# Altium schematic sheet sch1.SchDoc: Интерфейc PWB
size 420 x 297 mm; CheckedBy: Станкевич; Author: Семенюк; CompanyName: БГУИР, гр.750701; DrawnBy: Семенюк; Organization: БГУИР, гр.750701; Address1: Address1; Address2: Address2; Address3: Address3; Address4: Address4; DocumentNumber: АБВГ.123456.001 Э3; SheetNumber: 1; SheetTotal: 5; Scale: 1:1; Title2str: Микроконтроллер; DocumentType: Схема электрическая принципиальная; FirstReferrence: АБВГ.123456.001
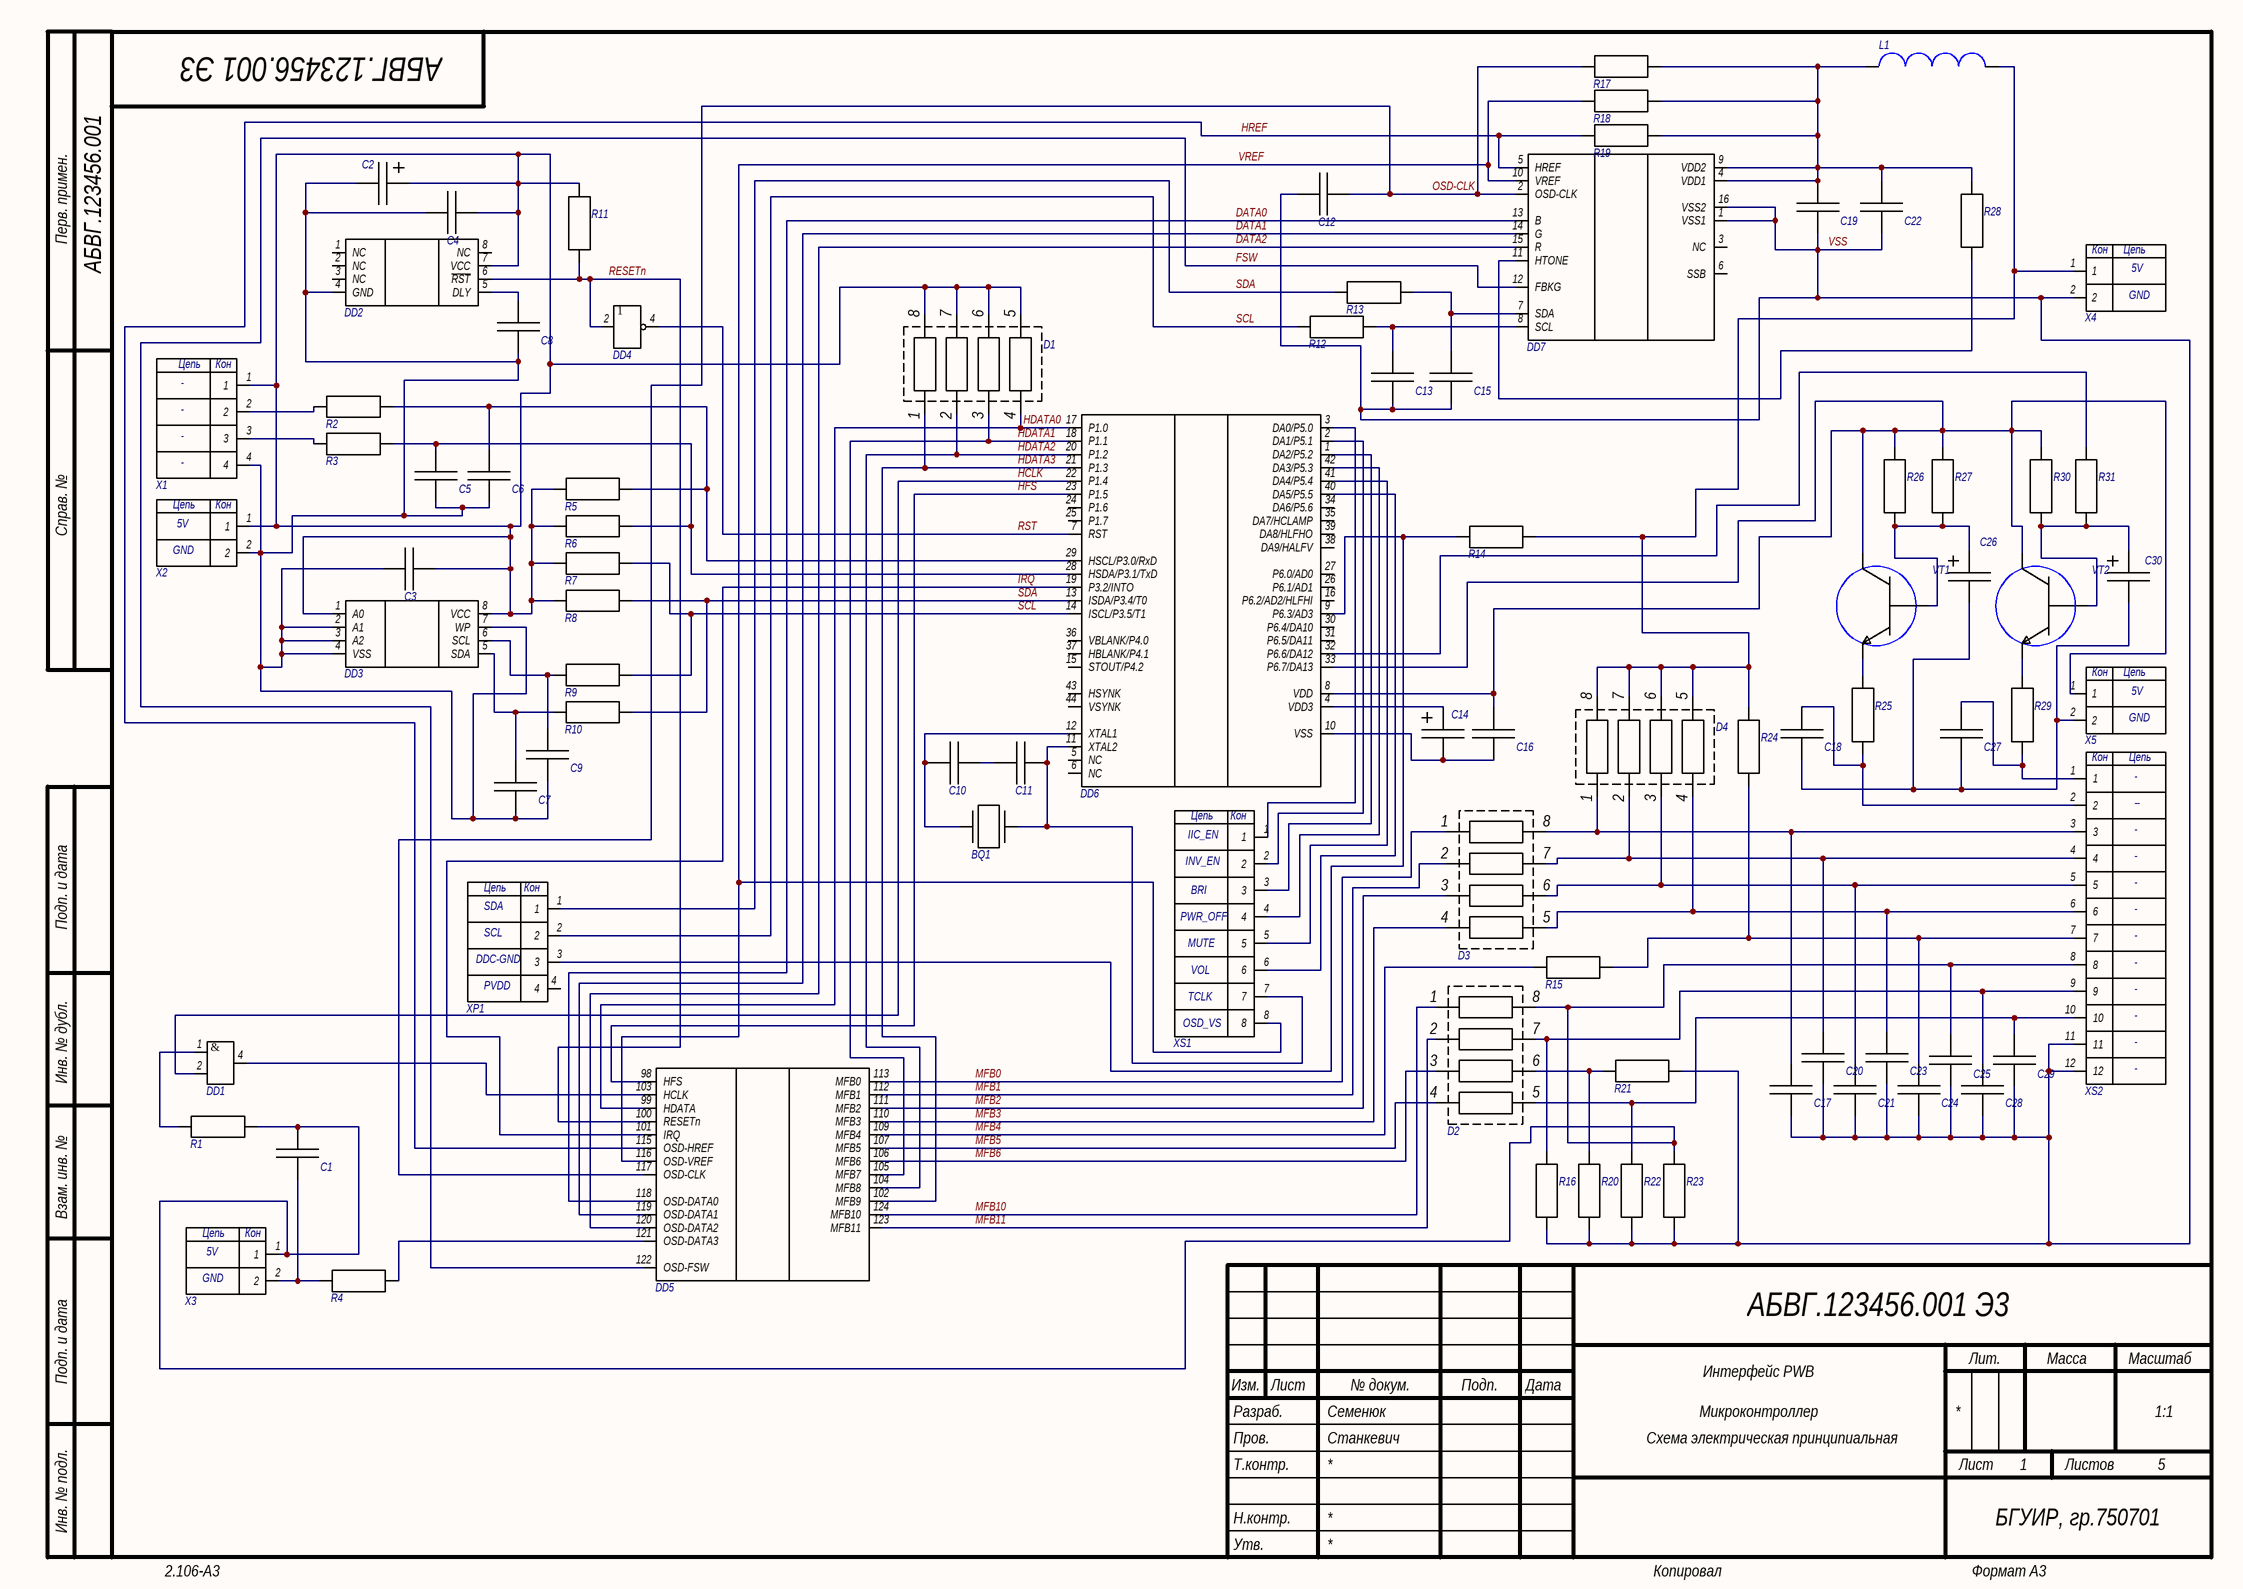
[diagram p0: sch1.SchDoc]

## Parts
BQ1  Crystal  [Crystal]  (value not drawn)
C1  Capacitor  [cap(0603)]  (value not drawn)
C2  Capacitor Duga  [Capacitor 0805]  (value not drawn)
C3  Capacitor  [cap(0603)]  (value not drawn)
C4  Capacitor  [cap(0603)]  (value not drawn)
C5  Capacitor  [cap(0603)]  (value not drawn)
C6  Capacitor  [cap(0603)]  (value not drawn)
C7  Capacitor  [cap(0603)]  (value not drawn)
C8  Capacitor  [cap(0603)]  (value not drawn)
C9  Capacitor  [cap(0603)]  (value not drawn)
C10  Capacitor  [cap(0603)]  (value not drawn)
C11  Capacitor  [cap(0603)]  (value not drawn)
C12  Capacitor  [cap(0603)]  (value not drawn)
C13  Capacitor  [cap(0603)]  (value not drawn)
C14  Capacitor Duga  [Capacitor 0805]  (value not drawn)
C15  Capacitor  [cap(0603)]  (value not drawn)
C16  Capacitor  [cap(0603)]  (value not drawn)
C17  Capacitor  [cap(0603)]  (value not drawn)
C18  Capacitor  [cap(0603)]  (value not drawn)
C19  Capacitor  [cap(0603)]  (value not drawn)
C20  Capacitor  [cap(0603)]  (value not drawn)
C21  Capacitor  [cap(0603)]  (value not drawn)
C22  Capacitor  [cap(0603)]  (value not drawn)
C23  Capacitor  [cap(0603)]  (value not drawn)
C24  Capacitor  [cap(0603)]  (value not drawn)
C25  Capacitor  [cap(0603)]  (value not drawn)
C26  Capacitor Duga  [Capacitor 0805]  (value not drawn)
C27  Capacitor  [cap(0603)]  (value not drawn)
C28  Capacitor  [cap(0603)]  (value not drawn)
C29  Capacitor  [cap(0603)]  (value not drawn)
C30  Capacitor Duga  [Capacitor 0805]  (value not drawn)
D1  RN  [RN]  (value not drawn)
D2  RN  [RN]  (value not drawn)
D3  RN  [RN]  (value not drawn)
D4  RN  [RN]  (value not drawn)
DD1  Сonjuncture  [Conjuncture]  (value not drawn)
DD2  M51953A  [M51953A]  (value not drawn)
DD3  24LC32  [24LC32]  (value not drawn)
DD4  Inverter  [Inverter]  (value not drawn)
DD5  gmZAN1  [GMZAN1]  (value not drawn)
DD6  MTV312M64  [MTV312M64]  (value not drawn)
DD7  I311  [I311]  (value not drawn)
L1  Inductor  [Inductor 2520]  (value not drawn)
R1  Resistor  [Resistor 1206]  (value not drawn)
R2  Resistor  [Resistor 1206]  (value not drawn)
R3  Resistor  [Resistor 1206]  (value not drawn)
R4  Resistor  [Resistor 1206]  (value not drawn)
R5  Resistor  [Resistor 1206]  (value not drawn)
R6  Resistor  [Resistor 1206]  (value not drawn)
R7  Resistor  [Resistor 1206]  (value not drawn)
R8  Resistor  [Resistor 1206]  (value not drawn)
R9  Resistor  [Resistor 1206]  (value not drawn)
R10  Resistor  [Resistor 1206]  (value not drawn)
R11  Resistor  [Resistor 1206]  (value not drawn)
R12  Resistor  [Resistor 1206]  (value not drawn)
R13  Resistor  [Resistor 1206]  (value not drawn)
R14  Resistor  [Resistor 1206]  (value not drawn)
R15  Resistor  [Resistor 1206]  (value not drawn)
R16  Resistor  [Resistor 1206]  (value not drawn)
R17  Resistor  [Resistor 1206]  (value not drawn)
R18  Resistor  [Resistor 1206]  (value not drawn)
R19  Resistor  [Resistor 1206]  (value not drawn)
R20  Resistor  [Resistor 1206]  (value not drawn)
R21  Resistor  [Resistor 1206]  (value not drawn)
R22  Resistor  [Resistor 1206]  (value not drawn)
R23  Resistor  [Resistor 1206]  (value not drawn)
R24  Resistor  [Resistor 1206]  (value not drawn)
R25  Resistor  [Resistor 1206]  (value not drawn)
R26  Resistor  [Resistor 1206]  (value not drawn)
R27  Resistor  [Resistor 1206]  (value not drawn)
R28  Resistor  [Resistor 1206]  (value not drawn)
R29  Resistor  [Resistor 1206]  (value not drawn)
R30  Resistor  [Resistor 1206]  (value not drawn)
R31  Resistor  [Resistor 1206]  (value not drawn)
VT1  Transistor 2_1  [Transistor 1]  (value not drawn)
VT2  Transistor 2_1  [Transistor 1]  (value not drawn)
X1  Header 4  [Header 4]  (value not drawn)
X2  5V-GND  [VCC-GND]  (value not drawn)
X3  5V-GND  [VCC-GND]  (value not drawn)
X4  5V-GND_1  [VCC-GND]  (value not drawn)
X5  5V-GND_1  [VCC-GND]  (value not drawn)
XP1  All pins_1  [Header 4]  (value not drawn)
XS1  All pins  [All pins]  (value not drawn)
XS2  Header 12  [All pins]  (value not drawn)

## Nets
GND: DD1.3(GND) DD4.3(GND)
VCC: DD1.5(VCC) DD4.5(VCC)
DATA0: DD5.118(OSD-DATA0) DD7.13(B)
DATA1: DD5.119(OSD-DATA1) DD7.14(G)
DATA2: DD5.120(OSD-DATA2) DD7.15(R)
FSW: DD5.122(OSD-FSW) DD7.12(FBKG)
HCLK: DD1.2 DD6.22(P1.4)
HDATA0: D1.4 DD5.99(HDATA) DD6.17(P1.0)
HDATA1: D1.3 DD5.105(MFB7) DD6.18(P1.1)
HDATA2: D1.2 DD5.104(MFB8) DD6.20(P1.2)
HDATA3: D1.1 DD5.102(MFB9) DD6.21(P1.3)
HFS: DD5.98(HFS) DD6.23(P1.5)
HREF: DD5.115(OSD-HREF) DD7.5(HREF) R19.1
IRQ: DD5.101(IRQ) DD6.19(P3.2/INTO)
MFB0: D3.1 DD5.113(MFB0)
MFB1: D3.2 DD5.112(MFB1)
MFB2: D3.3 DD5.111(MFB2)
MFB3: D3.4 DD5.110(MFB3)
MFB4: DD5.109(MFB4) R15.1
MFB5: D2.4 DD5.107(MFB5)
MFB6: D2.3 DD5.106(MFB6)
MFB10: D2.1 DD5.124(MFB10)
MFB11: D2.2 DD5.123(MFB11)
OSD-CLK: C12.1 DD5.117(OSD-CLK) DD7.2(OSD-CLK) R17.1
RESETn: DD2.6(~{RST}) DD4.2 DD5.100(RESETn) R11.1
RST: DD4.4 DD6.7(RST)
SCL: DD6.14(ISCL/P3.5/T1) R7.2 R9.2 R12.1 XP1.2
SDA: DD6.13(ISDA/P3.4/T0) R8.2 R10.2 R13.1 XP1.1
VREF: DD5.116(OSD-VREF) DD7.10(VREF) R18.1 XS1.8
VSS: C12.2 C13.1 C15.1 C17.1 C19.1 C20.1 C21.1 C22.1 C23.1 C24.1 C25.1 C28.1 C29.1 DD7.1(VSS1) DD7.16(VSS2) R16.1 R20.1 R21.2 R22.1 R23.1 X4.2 XS2.11 XS2.12
NetBQ1_1: BQ1.1 C10.2 DD6.12(XTAL1)
NetBQ1_2: BQ1.2 C11.1 DD6.11(XTAL2) XS1.7
NetC1_1: C1.1 R4.1 X3.2
NetC1_2: C1.2 C25.2 D2.8 R1.2 R23.2 X3.1 XS2.8
NetC2_1: C2.1 C3.2 C4.1 C5.1 C6.1 C7.1 C8.1 C9.1 DD2.4(GND) DD3.2(A1) DD3.3(A2) DD3.4(VSS) DD3.7(WP) X1.4 X2.2
NetC2_2: C2.2 C3.1 C4.2 D1.5 D1.6 D1.7 D1.8 DD2.7(VCC) DD3.1(A0) DD3.8(VCC) R5.1 R6.1 R7.1 R8.1 R11.2 X1.1 X2.1
NetC5_2: C5.2 DD6.28(HSDA/P3.1/TxD) R3.2 R6.2
NetC6_2: C6.2 DD6.29(HSCL/P3.0/RxD) R2.2 R5.2
NetC7_2: C7.2 DD3.5(SDA) R10.1
NetC8_2: C8.2 DD2.5(DLY)
NetC9_2: C9.2 DD3.6(SCL) R9.1
NetC10_1: C10.1 C11.2
NetC13_2: C13.2 DD7.8(SCL) R12.2
NetC14_1: C14.1 C16.1 DD6.10(VSS)
NetC14_2: C14.2 DD6.4(VDD3)
NetC15_2: C15.2 DD7.7(SDA) R13.2
NetC16_2: C16.2 DD6.8(VDD) DD6.33(P6.7/DA13) R26.1 R27.1 R30.1 VT1.1(KOLLECTOR) VT2.1(KOLLECTOR) X5.1
NetC17_2: C17.2 D3.8 D4.1 XS2.3
NetC18_1: C18.1 C26.1 C27.1 C30.1 X5.2
NetC18_2: C18.2 R25.2 XS2.2
NetC19_2: C19.2 C22.2 DD7.4(VDD1) DD7.9(VDD2) L1.1 R17.2 R18.2 R19.2 R28.2
NetC20_2: C20.2 D3.7 D4.2 XS2.4
NetC21_2: C21.2 D3.6 D4.3 XS2.5
NetC23_2: C23.2 D3.5 D4.4 XS2.6
NetC24_2: C24.2 R15.2 R24.1 XS2.7
NetC26_2: C26.2 R26.2 R27.2 VT1.3(BAZA)
NetC27_2: C27.2 R29.2 XS2.1
NetC28_2: C28.2 D2.7 R16.2 XS2.9
NetC29_2: C29.2 D2.5 R22.2 XS2.10
NetC30_2: C30.2 R30.2 R31.2 VT2.3(BAZA)
NetD2_6: D2.6 R20.2 R21.1
NetD4_5: D4.5 D4.6 D4.7 D4.8 L1.2 R14.2 R24.2 X4.1
NetDD1_1: DD1.1 R1.1
NetDD1_4: DD1.4 DD5.103(HCLK)
NetDD5_121: DD5.121(OSD-DATA3) R4.2
NetDD6_1: DD6.1(DA2/P5.2) XS1.3
NetDD6_2: DD6.2(DA1/P5.1) XS1.2
NetDD6_3: DD6.3(DA0/P5.0) XS1.1
NetDD6_9: DD6.9(P6.3/AD3) R14.1 XP1.3
NetDD6_32: DD6.32(P6.6/DA12) R31.1
NetDD6_40: DD6.40(DA5/P5.5) XS1.6
NetDD6_41: DD6.41(DA4/P5.4) XS1.5
NetDD6_42: DD6.42(DA3/P5.3) XS1.4
NetDD7_11: DD7.11(HTONE) R28.1
NetR2_1: R2.1 X1.2
NetR3_1: R3.1 X1.3
NetR25_1: R25.1 VT1.2(EMITTER)
NetR29_1: R29.1 VT2.2(EMITTER)

Not connected (* = marked no-connect by the designer): DD1 6(NC); DD2 1(NC) 2(NC) 3(NC) 8(NC); DD4 1(NC); DD6 5(NC) 6(NC) 15(STOUT/P4.2) 16(P6.2/AD2/HLFHI) 24(P1.6) 25(P1.7) 26(P6.1/AD1) 27(P6.0/AD0) 30(P6.4/DA10) 31(P6.5/DA11) 34(DA6/P5.6) 35(DA7/HCLAMP) 36(VBLANK/P4.0) 37(HBLANK/P4.1) 38(DA9/HALFV) 39(DA8/HLFHO) 43(HSYNK) 44(VSYNK); DD7 3(NC) 6(SSB); XP1 4

## Notes on the sheet
- Перв. примен.
- Справ. №
- Подп. и дата
- Инв. № дубл.
- Взам. инв. №
- Разраб.
- Изм.
- Лист
- № докум.
- Подп.
- Дата
- Лит.
- Масса
- Масштаб
- Пров.
- Т.контр.
- Листов
- Инв. № подл.
- Утв.
- Н.контр.
- 2.106-A3
- Копировал
- Формат А3
- (in symbol 5V-GND) Цепь; Кон; 5V; GND
- (in symbol 5V-GND_1) Кон; Цепь; 5V; GND
- (in symbol All pins) Цепь; Кон; IIC_EN; INV_EN; BRI; PWR_OFF; MUTE; VOL; TCLK; OSD_VS
- (in symbol All pins_1) Цепь; Кон; SDA; SCL; DDC-GND; PVDD
- (in symbol Header 4) Цепь; Кон; -
- (in symbol Header 12) Кон; Цепь; -
- (in symbol Сonjuncture) &

## Library data of the parts
C1 C3-C13 C15-C25 C27-C29 = Capacitor: Model: *
C2 C14 C26 C30 = Capacitor Duga: Model: *
L1 = Inductor: Model: *
R1-R31 = Resistor: Model: *